# Altium schematic sheet legacy-usr_interface.SchDoc: UserInterface
size A3; Author: Martín Ramírez Espinosa; Revision: 1.0; SheetNumber: 3; SheetTotal: 3
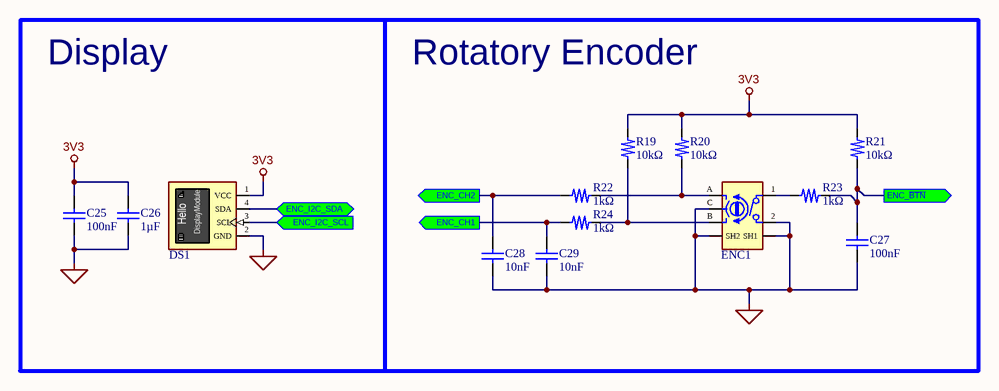
[diagram p0: legacy-usr_interface.SchDoc]

## Parts
C25  value 100nF  [CAPC2012X135N]  (hidden comment: CC0805KRX7R9BB104)
C26  value 1µF  [CAPC2012X135N]  (hidden comment: CL21B105KBFNNNE)
C27  value 100nF  [CAPC2012X135N]  (hidden comment: CC0805KRX7R9BB104)
C28  value 10nF  [CAPC2012X135N]  (hidden comment: CL21B103KBANNNC)
C29  value 10nF  [CAPC2012X135N]  (hidden comment: CL21B103KBANNNC)
DS1  WEA012864DWPP3N00003  [OLEDMOD_THT_4P_27P3X27P3_I2C_MH4]  (value not drawn)
ENC1  PEC11R-4220F-S0024  [ROTENC_PTH_5P_SW_PEC11R]  (value not drawn)
R19  value 10kΩ  [RESC2012]  (hidden comment: RC0805FR-0710KL)
R20  value 10kΩ  [RESC2012]  (hidden comment: RC0805FR-0710KL)
R21  value 10kΩ  [RESC2012]  (hidden comment: RC0805FR-0710KL)
R22  value 1kΩ  [RESC2012]  (hidden comment: RC0805FR-071KL)
R23  value 1kΩ  [RESC2012]  (hidden comment: RC0805FR-071KL)
R24  value 1kΩ  [RESC2012]  (hidden comment: RC0805FR-071KL)

## Ports
ENC_CH1 (out, see audiolab[3B]), ENC_CH2 (out, see audiolab[3B]), ENC_I2C_SCL (in, see audiolab[3B]), ENC_I2C_SDA (bidir, see audiolab[3B]), ENC_~{BTN} (out, see audiolab[3B])

## Nets
3V3: C25.2 C26.2 DS1.1(VCC) R19.2 R20.2 R21.2
DGND: C25.1 C26.1 C27.1 C28.1 C29.1 DS1.2(GND) ENC1.2 ENC1.C(COM) ENC1.SH1 ENC1.SH2
ENC_~{BTN}: C27.2 R21.1 R23.2 ; port ENC_~{BTN}
ENC_CH1: C29.2 R24.1 ; port ENC_CH1
ENC_CH2: C28.2 R22.1 ; port ENC_CH2
ENC_I2C_SCL: DS1.3(SCL) ; port ENC_I2C_SCL
ENC_I2C_SDA: DS1.4(SDA) ; port ENC_I2C_SDA
NetENC1_1: ENC1.1 R23.1
NetENC1_A: ENC1.A R20.1 R22.2
NetENC1_B: ENC1.B R19.1 R24.2

## Notes on the sheet
- Display
- Rotatory Encoder
- (in symbol WEA012864DWPP3N00003) Hello; DisplayModule

## Library data of the parts
C25 C27 = CC0805KRX7R9BB104: 50V 100nF X7R ±10% 0805 Multilayer Ceramic Capacitors MLCC - SMD/SMT ROHS; Manufacturer: YAGEO; Supplier: DigiKey; Supplier Part Number: 311-1140-1-ND; Manufacturer Part Number: CC0805KRX7R9BB104; Package/Case: 0805 (2012 Metric)
C26 = CL21B105KBFNNNE: 50V 1uF X7R ±10% 0805 Multilayer Ceramic Capacitors MLCC - SMD/SMT ROHS; Manufacturer: Samsung Electro-Mechanics; Supplier: DigiKey; Supplier Part Number: 1276-1029-1-ND; Manufacturer Part Number: CL21B105KBFNNNE; Package/Case: 0805 (2012 Metric)
C28 C29 = CL21B103KBANNNC: 50V 10nF X7R ±10% 0805 Multilayer Ceramic Capacitors MLCC - SMD/SMT ROH; Manufacturer: Samsung Electro-Mechanics; Supplier: DigiKey; Supplier Part Number: 1276-1015-1-ND; Manufacturer Part Number: CL21B103KBANNNC; Package/Case: 0805 (2012 Metric)
DS1 = WEA012864DWPP3N00003: Winstar WEA012864DWPP3N00003 OLED COG 128X64 white 0.96"on PCB I2C; Manufacturer: Winstar Display; Value: *; Supplier Part Number: 4863-WEA012864DWPP3N00003-ND; Supplier: DigiKey; Manufacturer Part Number: WEA012864DWPP3N00003; Package/Case: Tray
ENC1 = PEC11R-4220F-S0024: Incremental Encoder 24 PPR 2 Bit Quadrature 5VDC at 10 mA IP40 PCB Mount 60RPM; Manufacturer: Bourns Inc.; Value: *; Supplier Part Number: PEC11R-4220F-S0024-ND; Supplier: DigiKey; Manufacturer Part Number: PEC11R-4220F-S0024; Package/Case: Tray
R19-R21 = RC0805FR-0710KL: Res Thick Film 0805 10K Ohm 1% 0.125W(1/8W) +/-100ppm/C Epoxy Pad SMD T/R; Manufacturer: YAGEO; Supplier: DigiKey; Supplier Part Number: 311-10.0KCRCT-ND; Manufacturer Part Number: RC0805FR-0710KL; Package/Case: 0805 (2012 Metric)
R22-R24 = RC0805FR-071KL: 125Mw Thick Film Resistors 100Ppm/ 1% 4.7K 0805 Chip Resistor Surface Mount Rohs; Manufacturer: YAGEO; Supplier: DigiKey; Supplier Part Number: 311-1.00KCRCT-ND; Manufacturer Part Number: RC0805FR-071KL; Package/Case: 0805 (2012 Metric)